# Altium schematic sheet FAT35o.SchDoc
size A4
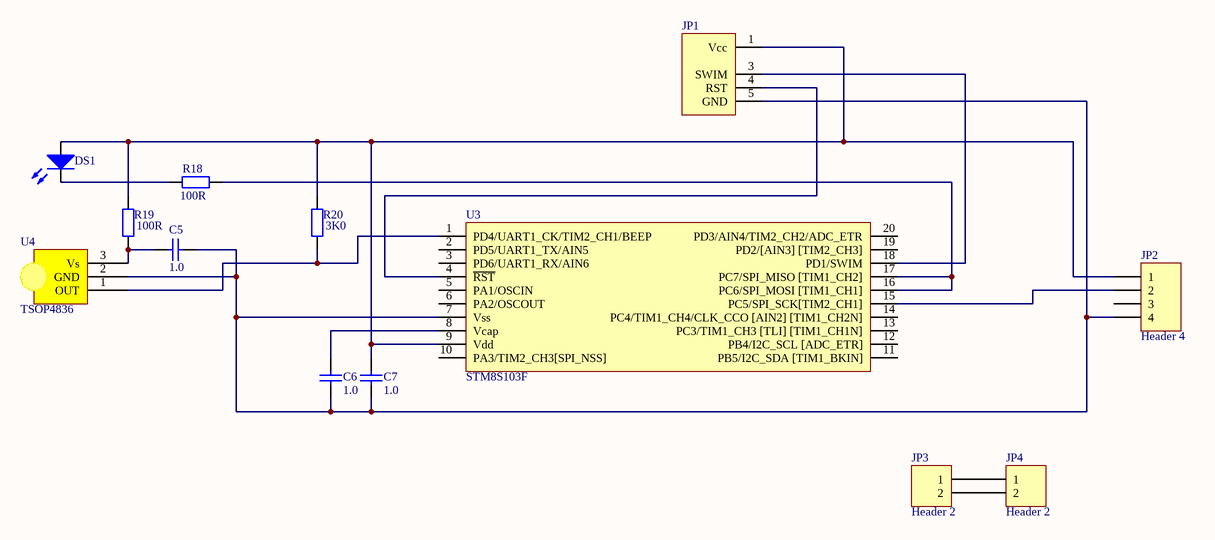
[diagram p0: FAT35o.SchDoc]

## Parts
C5  1.0  [_1206]
C6  1.0  [_1206]
C7  1.0  [_1206]
DS1  (no value)  [HDR1X2]
JP1  (no value)  [HDR1X5_uart]
JP2  Header 4  [HDR2X2]
JP3  Header 2  [HDR1X2]
JP4  Header 2  [HDR1X2]
R18  100R  [_1206]
R19  100R  [_1206]
R20  3K0  [_1206]
U3  (no value)  [TSSO6x6-G20/Y1.6]
U4  TSOP4836  [TSOP4836]

## Nets
NetC5_1: C5.1 C6.1 C7.1 JP1.5(GND) JP2.4 U3.7(Vss) U4.2(GND)
NetC5_2: C5.2 R19.2 U4.3(Vs)
NetC6_2: C6.2 U3.8(Vcap)
NetC7_2: C7.2 DS1.1(A) JP1.1(Vcc) JP2.1 R19.1 R20.1 U3.9(Vdd)
NetDS1_2: DS1.2(K) R18.2
NetJP1_3: JP1.3(SWIM) U3.18(PD1/SWIM)
NetJP1_4: JP1.4(RST) U3.4(~{RST})
NetJP2_2: JP2.2 U3.15(PC5/SPI_SCK[TIM2_CH1])
NetJP3_1: JP3.1 JP4.1
NetJP3_2: JP3.2 JP4.2
NetR18_1: R18.1 U3.16(PC6/SPI_MOSI_[TIM1_CH1]) U3.17(PC7/SPI_MISO_[TIM1_CH2])
NetR20_2: R20.2 U3.1(PD4/UART1_CK/TIM2_CH1/BEEP) U4.1(OUT)

Not connected (* = marked no-connect by the designer): JP2 3; U3 2(PD5/UART1_TX/AIN5) 3(PD6/UART1_RX/AIN6) 5(PA1/OSCIN) 6(PA2/OSCOUT) 10(PA3/TIM2_CH3[SPI_NSS]) 11(PB5/I2C_SDA_[TIM1_BKIN]) 12(PB4/I2C_SCL_[ADC_ETR]) 13(PC3/TIM1_CH3_[TLI]_[TIM1_CH1N]) 14(PC4/TIM1_CH4/CLK_CCO_[AIN2]_[TIM1_CH2N]) 19(PD2/[AIN3]_[TIM2_CH3]) 20(PD3/AIN4/TIM2_CH2/ADC_ETR)

## Library data of the parts
C5-C7 = Cap Semi: Capacitor (Semiconductor SIM Model); Manufacturer: Generic Components; Class I: Passive; Value: 0,1; Published: 8-Jun-2000; Revision: July-2002: Re-released for DXP Platform.; Publisher: Altium Limited; Class II: Capacitor
DS1 = LED0: Typical INFRARED GaAs LED; Manufacturer: Generic Components; Class I: Optoelectronic; Published: 8-Jun-2000; Revision: July-2002: Re-released for DXP Platform.; Publisher: Altium Limited; Class II: LED
JP1 = SWIM_CONN
JP2 = Header 4: Header, 4-Pin; Manufacturer: Generic Components; Class I: Connector; Revision: July-2002: Re-released for DXP Platform.; Publisher: Altium Limited
JP3 JP4 = Header 2: Header, 2-Pin; Manufacturer: Generic Components; Class I: Connector; Revision: July-2002: Re-released for DXP Platform.; Publisher: Altium Limited
R18 R19 = Res2: Resistor; Manufacturer: Generic Components; Class I: Passive; Value: 1K0; Rule: Undefined; Published: 8-Jun-2000; Revision: July-2002: Re-released for DXP Platform.; Publisher: Altium Limited; Class II: Resistor
R20 = Res2: Resistor; Manufacturer: Generic Components; Class I: Passive; Value: 10K; Rule: Undefined; Published: 8-Jun-2000; Revision: July-2002: Re-released for DXP Platform.; Publisher: Altium Limited; Class II: Resistor
U3 = STM8S103F